# EAGLE design tinyPCB (EAGLE 9.2.0)
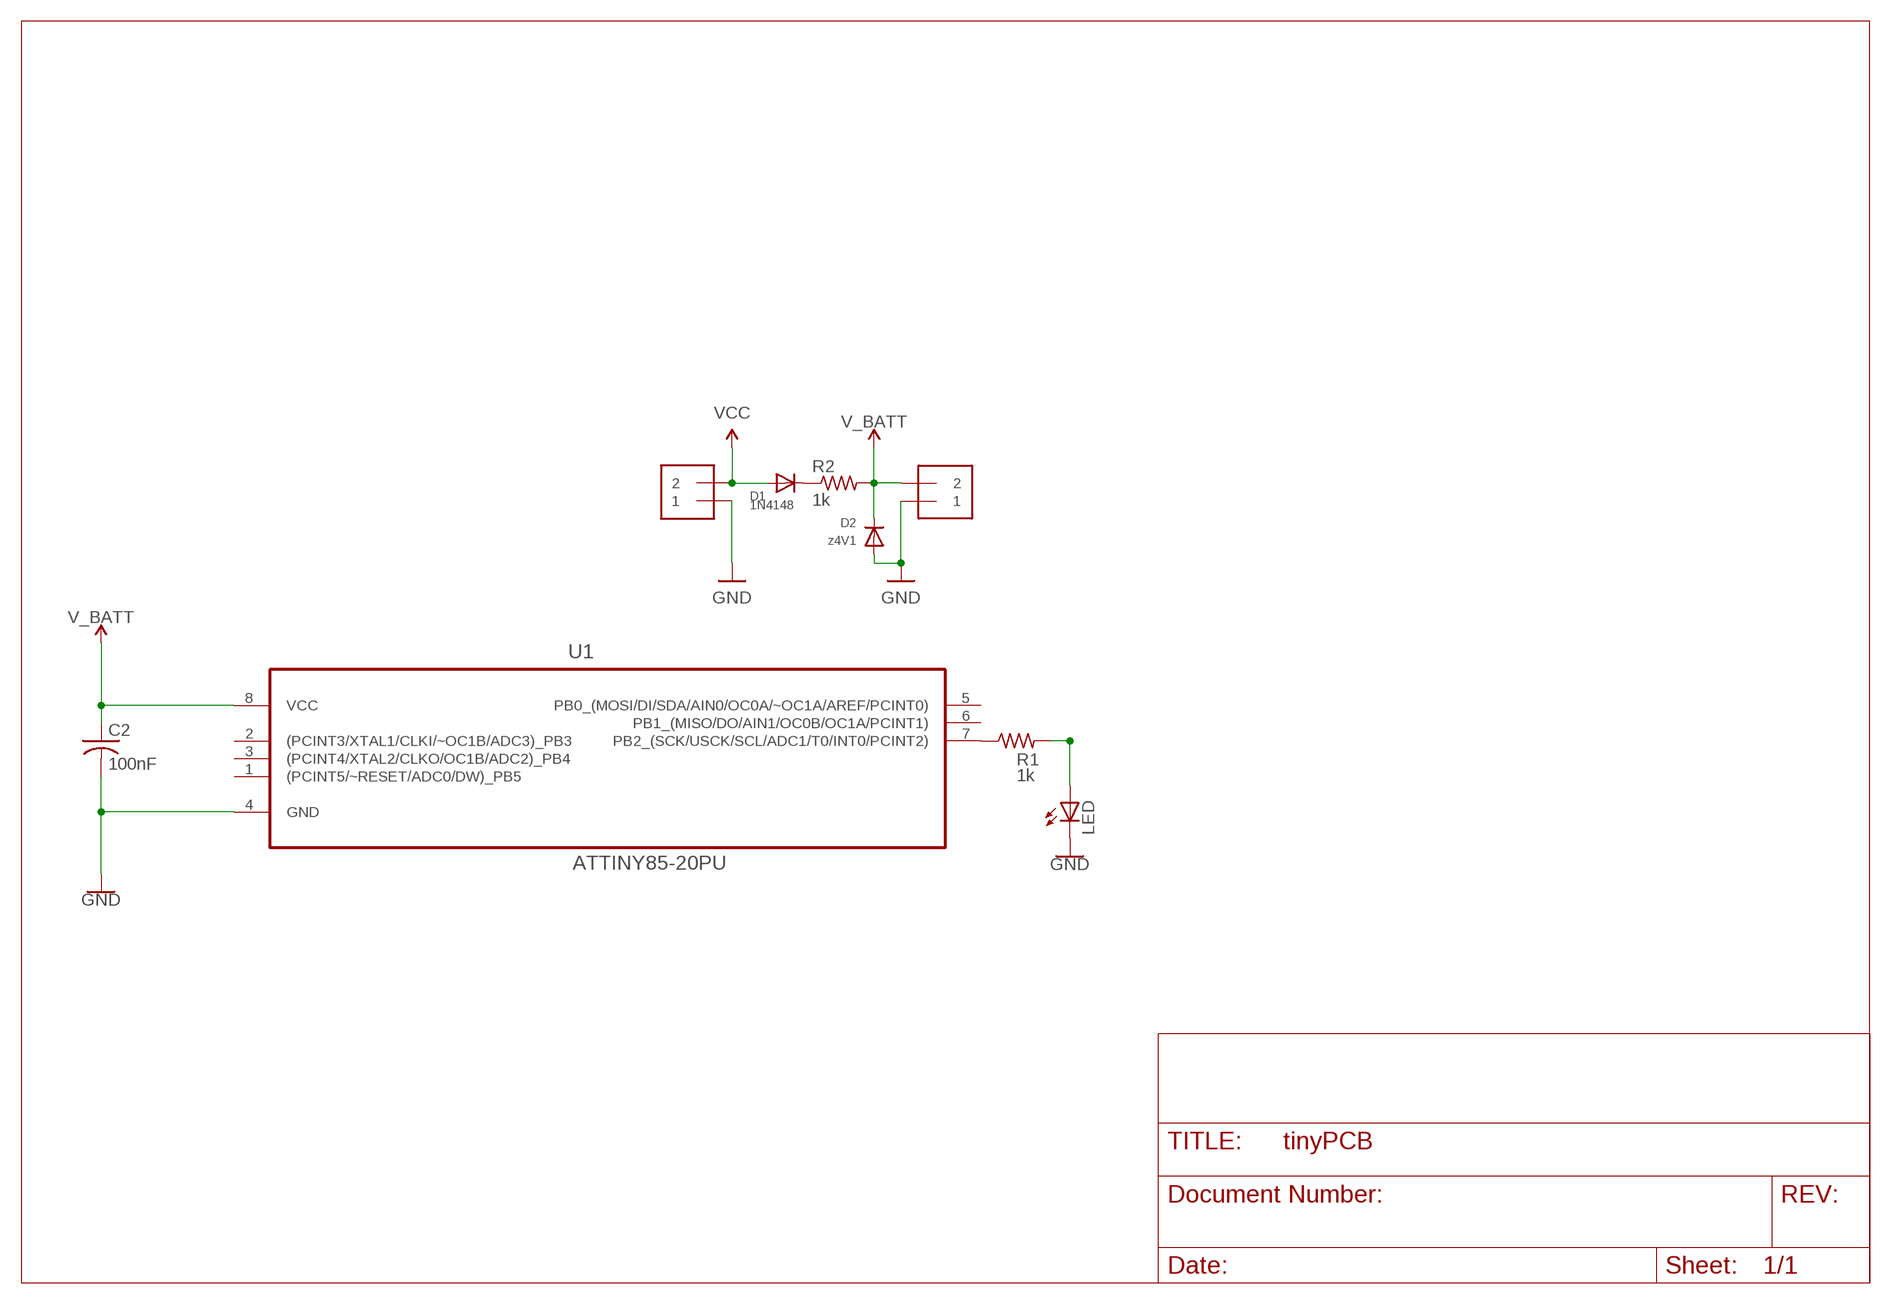
[diagram p0: schematic, sheet 1]

## Parts
BAT  1X2-3.5MM  [1X2-3.5MM]
C2  100nF  C-US050-025X075  [C050-025X075]
CHG  1X2-3.5MM  [1X2-3.5MM]
D1  1N4148  DIODEDO-1N4148  [DO-1N4148]
D2  z4V1  DIODEDO-1N4148  [DO-1N4148]
LED  LED5MM  [LED5MM]
R1  1k  R-US_0204/7  [0204/7]
R2  1k  R-US_0204/7  [0204/7]
U1  ATTINY85-20PU  [DIP254P762X533-8]

## Nets
GND: BAT.1 C2.2 CHG.1 D2.A LED.K(C) U1.4(GND)
N$1: R1.1 U1.7(PB2_(SCK/USCK/SCL/ADC1/T0/INT0/PCINT2))
N$2: LED.A R1.2
N$6: D1.C R2.1
V_BATT: BAT.2 C2.1 D2.C R2.2 U1.8(VCC)
VCC: CHG.2 D1.A
Unconnected: U1.1((PCINT5/~RESET/ADC0/DW)_PB5) U1.2((PCINT3/XTAL1/CLKI/~OC1B/ADC3)_PB3) U1.3((PCINT4/XTAL2/CLKO/OC1B/ADC2)_PB4) U1.5(PB0_(MOSI/DI/SDA/AIN0/OC0A/~OC1A/AREF/PCINT0)) U1.6(PB1_(MISO/DO/AIN1/OC0B/OC1A/PCINT1))

## Library data of the parts
BAT CHG = adafruit:1X2: 3.5mm Terminal block http://www.ladyada.net/library/pcb/eaglelibrary.html
C2 = adafruit:C-US: CAPACITOR, American symbol
D1 D2 = adafruit:DIODE: Diode SMADIODE - SMA Surface Mount Package 20V 1A Schottky Diode Digikey: 641-1014-6-ND DO-1N4148 - Through Hole Small Current Diode SOD-123 20V 1 A (.5mV Vf) Schottky Diode - Digikey: MBRX120TPMSCT-ND SOD-323 10V 570mA (.38mV Vf, 3ns) Schottky Diode - Digikey: ZLLS410CT-ND SOD-523 30V 30mA Schottky Diode (RB751S-40TE61) - Digikey: RB751S-40TE61CT-ND SOT23-R/W - SOT23 Package (R = Solder Paste/Reflow Ovens, W = Hand-Soldering) BAT54Film 40V 300mA - Digikey: 497-7162-1-ND
LED = adafruit:LED: LED OSRAM: - CHIPLED LG R971, LG N971, LY N971, LG Q971, LY Q971, LO R971, LY R971 LH N974, LH R974 LS Q976, LO Q976, LY Q976 LO Q996 - Hyper CHIPLED LW Q18S LB Q993, LB Q99A, LB R99A - SideLED LS A670, LO A670, LY A670, LG A670, LP A670 LB A673, LV A673, LT A673, LW A673 LH A674 LY A675 LS A676, LA A676, LO A676, LY A676, LW A676 LS A679, LY A679, LG A679 - Hyper Micro SIDELED® LS Y876, LA Y876, LO Y876, LY Y876 LT Y87S - SmartLED LW L88C, LW L88S LB L89C, LB L89S, LG L890 LS L89K, LO L89K, LY L89K LS L896, LA L896, LO L896, LY L896 - TOPLED LS T670, LO T670, LY T670, LG T670, LP T670 LSG T670, LSP T670, LSY T670, LOP T670, LYG T670 LG T671, LOG T671, LSG T671 LB T673, LV T673, LT T673, LW T673 LH T674 LS T676, LA T676, LO T676, LY T676, LB T676, LH T676, LSB T676, LW T676 LB T67C, LV T67C, LT T67C, LS T67K, LO T67K, LY T67K, LW E67C LS E67B, LA E67B, LO E67B, LY E67B, LB E67C, LV E67C, LT E67C LW T67C LS T679, LY T679, LG T679 LS T770, LO T770, LY T770, LG T770, LP T770 LB T773, LV T773, LT T773, LW T773 LH T774 LS E675, LA E675, LY E675, LS T675 LS T776, LA T776, LO T776, LY T776, LB T776 LHGB T686 LT T68C, LB T68C - Hyper Mini TOPLED® LB M676 - Mini TOPLED Santana® LG M470 LS M47K, LO M47K, LY M47K Source: http://www.osram.convergy.de/
R1 R2 = adafruit:R-US_: RESISTOR, American symbol
U1 = ATTINY85-20PU:ATTINY85-20PU: 8-bit Microcontroller with In-System Programmable Flash; AVAILABILITY: Unavailable; DESCRIPTION: ATtiny Series 20 MHz 8 KB Flash 512 B SRAM 8-Bit Microcontroller - DIP-8; MF: Microchip; MP: ATTINY85-20PU; PACKAGE: DIP-8 Microchip; PRICE: None

## Board
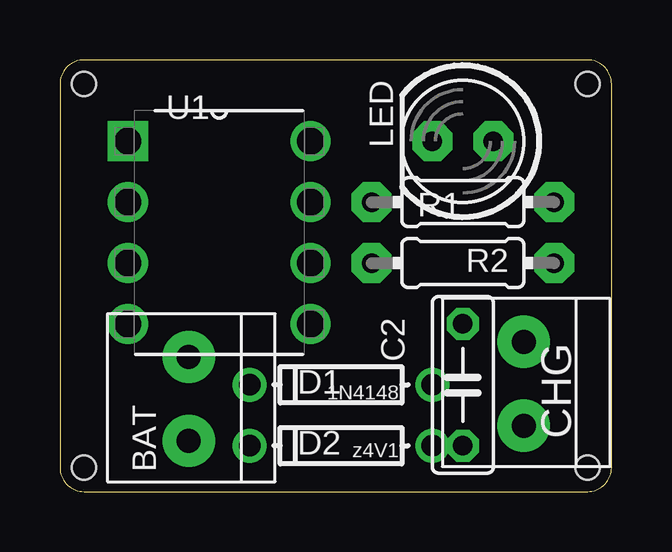
[diagram p1: board, top side]
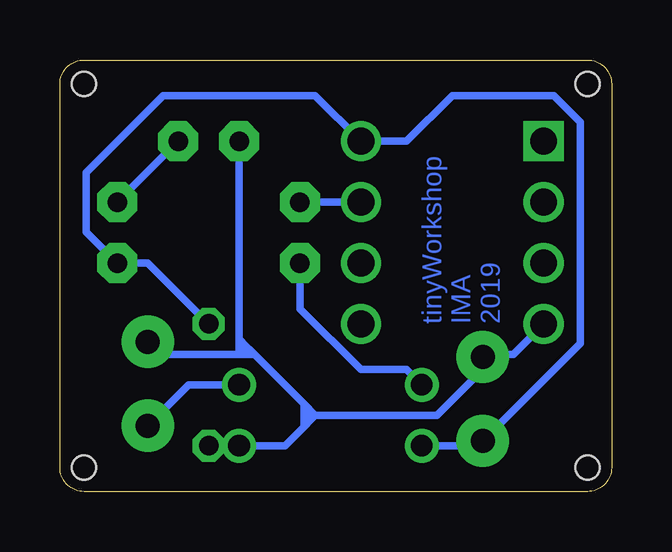
[diagram p2: board, bottom side, seen from below]

Size 23 x 18 mm. Coordinates in mm from the lower left corner, seen from the top.
Outline: 0,17 0,1 arc90 1,0 22,0 arc90 23,1 23,17 arc90 22,18 1,18 arc90 0,17
Copper layers (1*16): Top 0.035mm / dielectric 1.5mm / Bottom 0.035mm
Design rules "default *": minimum track width 12mil, minimum drill 0.7mm, track to track 12mil, track to pad 12mil, pad to pad 12mil, via to via 12mil, smd to smd 6mil, copper to edge 40mil, drill to drill 12mil, minimum pad ring 10mil, minimum via ring 8mil, stop-mask expansion 4mil, vias tented up to drill 0mil, thermal gap 10mil
Holes 1 mm at 1,17 22,17 22,1 1,1

### Footprints (pad centres in the part's own frame; a part is rotated, then mirrored left to right if it is on the bottom)
1X2-3.5MM = drill 1 pad 2.184: 1 1.8,0; 2 -1.7,0
C050-025X075 = drill 0.813 octagon: 1 -2.54,0; 2 2.54,0
DO-1N4148 = drill 0.9: A -3.81,0; C 3.81,0
LED5MM = drill 0.813 pad 1.676 octagon: A -1.27,0; K 1.27,0
0204/7 = drill 0.813 pad 1.676 octagon: 1 -3.81,0; 2 3.81,0
DIP254P762X533-8 = drill 1.118 square: 1 -7.62,7.62 | drill 1.118: 2 -7.62,5.08; 3 -7.62,2.54; 4 -7.62,0; 5 0,0; 6 0,2.54; 7 0,5.08; 8 0,7.62

### Placement (x,y rotation side)
BAT  5.37,3.81 90 top
C2  16.8,4.45 270 top
CHG  19.34,4.45 90 top
D1  11.72,4.45 180 top
D2  11.72,1.91 180 top
LED  16.8,14.61 180 top
R1  16.8,12.07 0 top
R2  16.8,9.53 0 top
U1  10.45,6.99 0 top

### Tracks (layer width: path | path; a pad name or v marks a point on that pad's centre or on a via)
GND
  Bottom 0.305: U1.4 4.1,5.72 5.37,5.72 BAT.1 5.37,5.09 7.27,3.18 12.35,3.18 | C2.2 D2.A 13.62,1.91 12.83,2.7 | LED.K 15.53,6.35 | 15.53,6.35 15.53,6.04 | 15.53,6.04 15.53,5.72 | 14.9,5.72 12.83,3.66 | 12.83,3.66 12.35,3.18 | 15.53,5.72 14.9,5.72 | 12.83,2.7 12.51,3.02 | 12.51,3.02 12.35,3.18 | CHG.1 18.81,5.72 15.53,5.72 | 14.9,5.72 15.05,5.88 15.21,6.04 | 15.21,6.04 15.53,6.35 | 12.83,3.66 12.83,3.18 | 12.83,3.18 12.83,2.7 | 12.51,3.02 12.67,3.18 12.83,3.18 | 15.21,6.04 15.53,6.04
N$1
  Bottom 0.305: R1.1 U1.7
N$2
  Bottom 0.305: R1.2 LED.A
N$6
  Bottom 0.305: D1.C 8.55,5.09 10.45,5.09 12.99,7.62 R2.1
V_BATT
  Bottom 0.305: D2.C 5.37,1.91 BAT.2 1.31,6.18 1.31,15.41 2.41,16.52 6.64,16.52 8.55,14.61 U1.8 12.35,16.52 18.7,16.52 21.91,13.31 21.91,10.83 R2.2 19.34,9.53 C2.1
VCC
  Bottom 0.305: D1.A 17.64,4.45 CHG.2

### Text on the board
Bottom: tinyWorkshop / IMA / 2019